# EAGLE design level shifter booster pack (EAGLE 6.4)
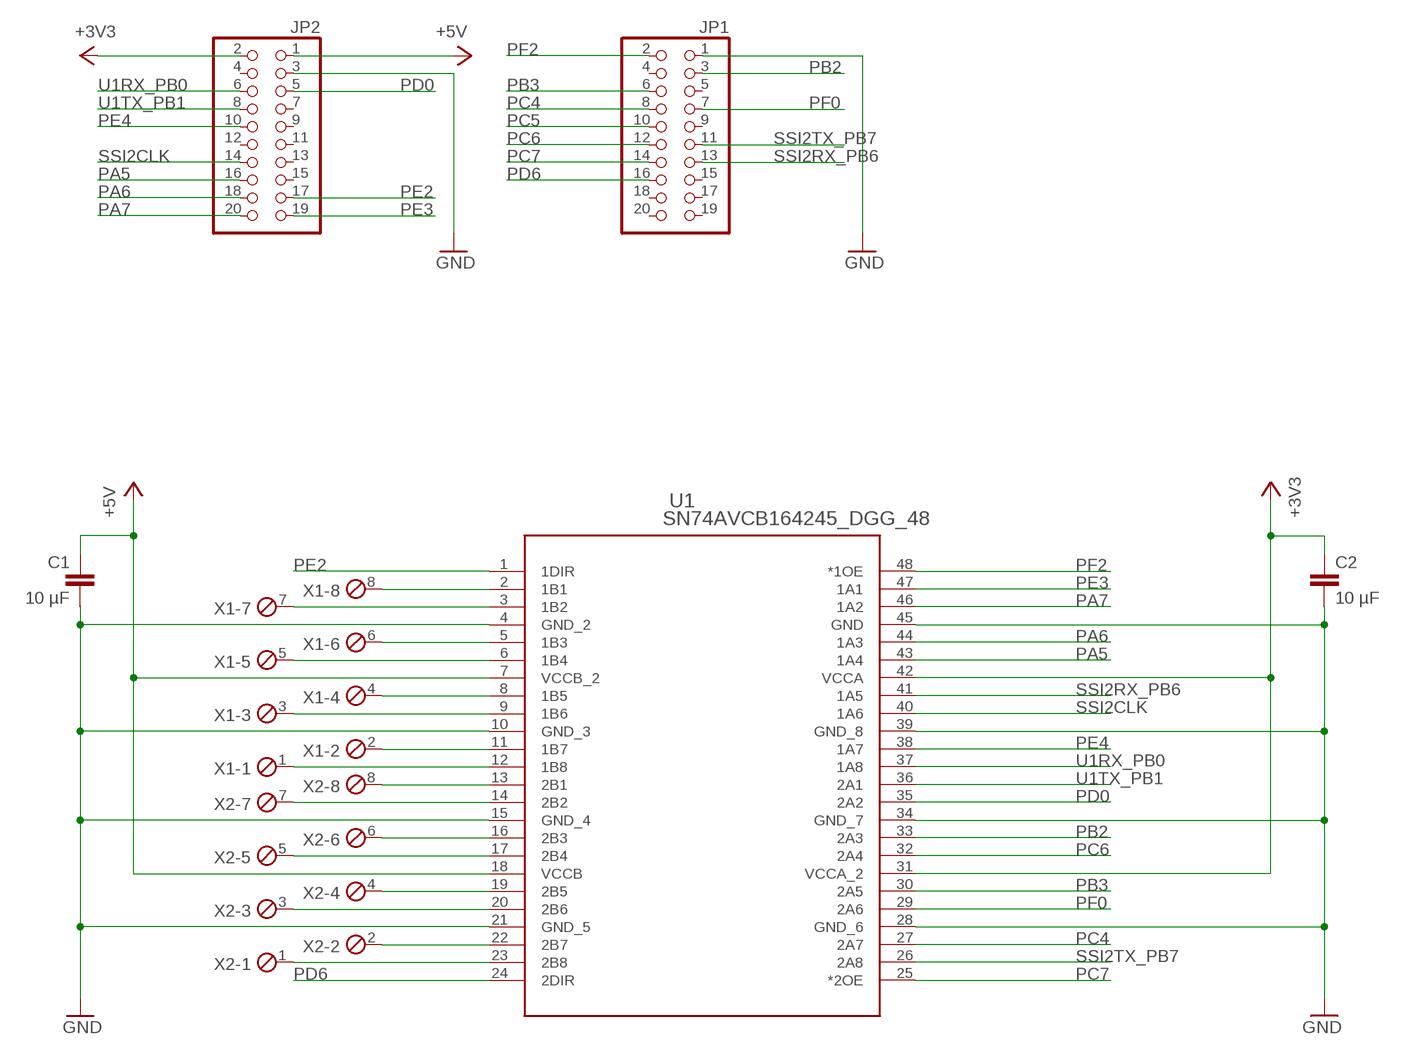
[diagram p0: schematic, sheet 1]

## Parts
C1  10 µF  C-EUC0805  [C0805]
C2  10 µF  C-EUC0805  [C0805]
JP1  PINHD-2X10  [2X10]
JP2  PINHD-2X10  [2X10]
U1  SN74AVCB164245_DGG_48  [DGG48]
X1  MPT8  [8POL254]
X2  MPT8  [8POL254]

## Nets
+3V3: C2.1 JP2.2 U1.31(VCCA_2) U1.42(VCCA)
+5V: C1.1 JP2.1 U1.7(VCCB_2) U1.18(VCCB)
GND: C1.2 C2.2 JP1.1 JP2.3 U1.4(GND_2) U1.10(GND_3) U1.15(GND_4) U1.21(GND_5) U1.28(GND_6) U1.34(GND_7) U1.39(GND_8) U1.45(GND)
N$1: U1.2(1B1) X1.8
N$2: U1.3(1B2) X1.7
N$3: U1.5(1B3) X1.6
N$4: U1.6(1B4) X1.5
N$5: U1.8(1B5) X1.4
N$6: U1.9(1B6) X1.3
N$7: U1.11(1B7) X1.2
N$8: U1.12(1B8) X1.1
N$9: U1.13(2B1) X2.8
N$10: U1.14(2B2) X2.7
N$11: U1.16(2B3) X2.6
N$12: U1.17(2B4) X2.5
N$13: U1.19(2B5) X2.4
N$14: U1.20(2B6) X2.3
N$15: U1.22(2B7) X2.2
N$16: U1.23(2B8) X2.1
PA5: JP2.16 U1.43(1A4)
PA6: JP2.18 U1.44(1A3)
PA7: JP2.20 U1.46(1A2)
PB2: JP1.3 U1.33(2A3)
PB3: JP1.6 U1.30(2A5)
PC4: JP1.8 U1.27(2A7)
PC5: JP1.10
PC6: JP1.12 U1.32(2A4)
PC7: JP1.14 U1.25(*2OE)
PD0: JP2.5 U1.35(2A2)
PD6: JP1.16 U1.24(2DIR)
PE2: JP2.17 U1.1(1DIR)
PE3: JP2.19 U1.47(1A1)
PE4: JP2.10 U1.38(1A7)
PF0: JP1.7 U1.29(2A6)
PF2: JP1.2 U1.48(*1OE)
SSI2CLK: JP2.14 U1.40(1A6)
SSI2RX_PB6: JP1.13 U1.41(1A5)
SSI2TX_PB7: JP1.11 U1.26(2A8)
U1RX_PB0: JP2.6 U1.37(1A8)
U1TX_PB1: JP2.8 U1.36(2A1)
Unconnected: JP1.4 JP1.5 JP1.9 JP1.15 JP1.17 JP1.18 JP1.19 JP1.20 JP2.4 JP2.7 JP2.9 JP2.11 JP2.12 JP2.13 JP2.15

## Library data of the parts
C1 C2 = rcl:C-EU: CAPACITOR, European symbol
JP1 JP2 = pinhead:PINHD-2X10: PIN HEADER
U1 = 74AVCB164245GR:SN74AVCB164245_DGG_48; DATASHEETURL: http://www.ti.com/lit/gpn/SN74AVCB164245; DESCRIPTION: 16-Bit Dual-Supply Bus Transceiver w/ Config. Xlation and 3-State Outputs; FAMILY_NAME: DIRECTION CONTROL DUAL SUPPLY TRANSLATOR; GENERIC_PART_NUMBER: SN74AVCB164245; INDUSTRY_STD_PKG_TYPE: TSSOP; MANUFACTURER: Texas Instruments; MANUFACTURER_PART_NUMBER: sn74avcb164245_dgg_48; PACKAGE_DESIGNATOR: DGG; PIN_COUNT: 48; VENDOR: Texas Instruments
X1 X2 = con-phoenix-254:MPT8: PHOENIX CONNECTOR; OC_FARNELL: unknown; OC_NEWARK: unknown

## Board
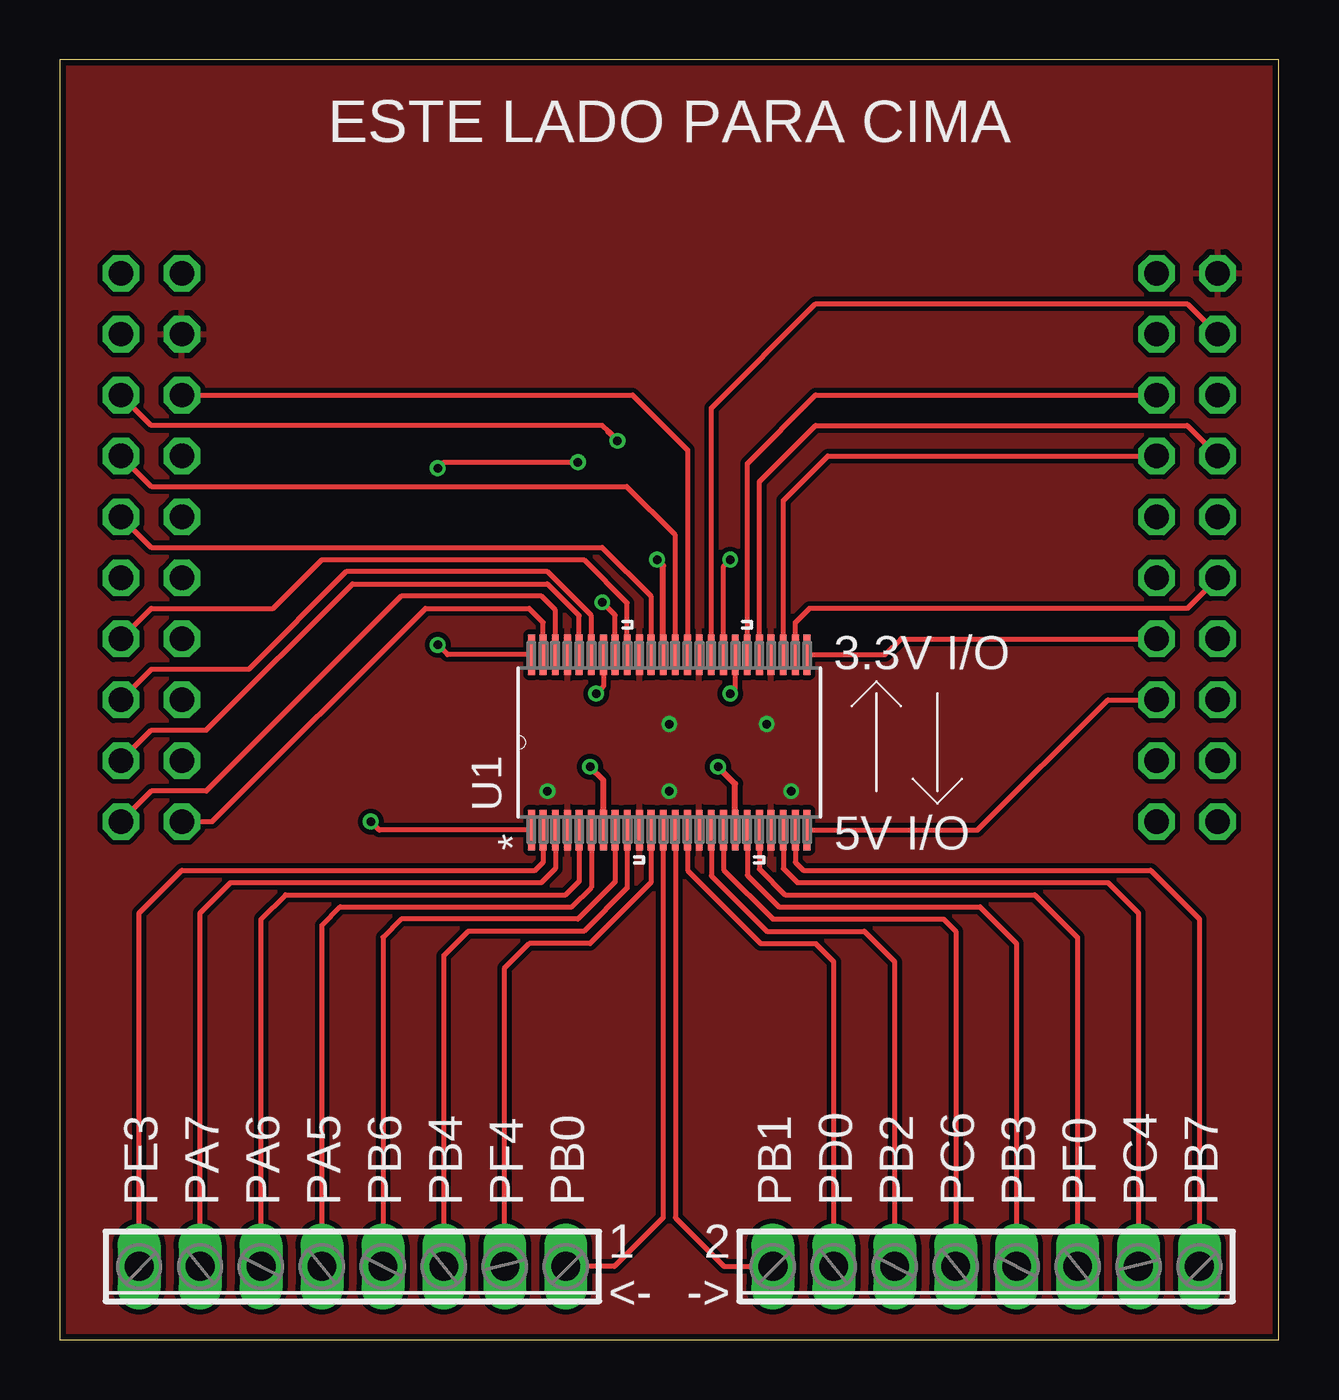
[diagram p1: board, top side]
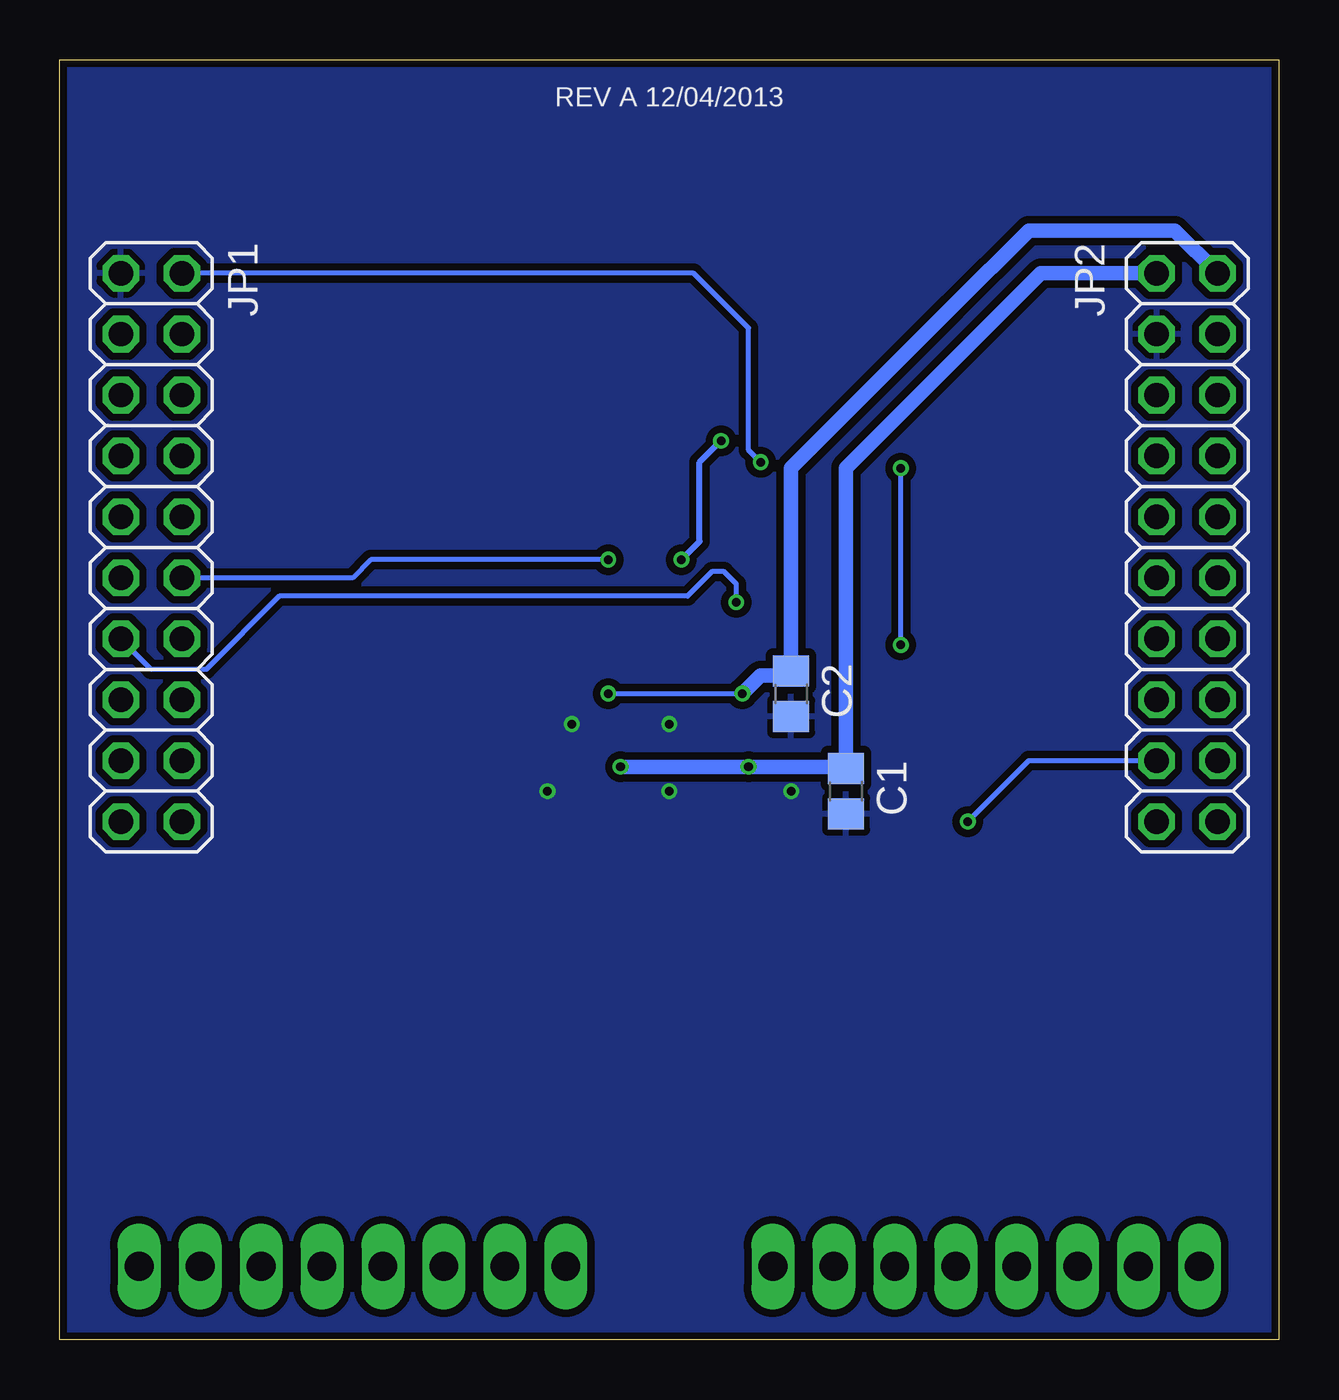
[diagram p2: board, bottom side, seen from below]

Size 50.8 x 53.34 mm. Coordinates in mm from the lower left corner, seen from the top.
Outline: 0,0 50.8,0 50.8,53.34 0,53.34 0,0
Copper layers (1*16): Top 0.035mm / dielectric 1.5mm / Bottom 0.035mm
Design rules "Fusion_eagle_rule_v1.1": minimum track width 6mil, minimum drill 12mil, track to track 6mil, track to pad 6mil, pad to pad 6mil, via to via 6mil, smd to smd 0mil, copper to edge 10mil, drill to drill 10mil, minimum pad ring 10mil, minimum via ring 6mil, stop-mask expansion 2mil, vias tented up to drill 100mil, thermal gap 10mil

### Footprints (pad centres in the part's own frame; a part is rotated, then mirrored left to right if it is on the bottom)
C0805 = smd 1.3 x 1.5: 1 -0.95,0; 2 0.95,0
2X10 = drill 1.016 octagon: 1 -11.43,-1.27; 2 -11.43,1.27; 3 -8.89,-1.27; 4 -8.89,1.27; 5 -6.35,-1.27; 6 -6.35,1.27; 7 -3.81,-1.27; 8 -3.81,1.27; 9 -1.27,-1.27; 10 -1.27,1.27; 11 1.27,-1.27; 12 1.27,1.27; 13 3.81,-1.27; 14 3.81,1.27; 15 6.35,-1.27; 16 6.35,1.27; 17 8.89,-1.27; 18 8.89,1.27; 19 11.43,-1.27; 20 11.43,1.27
DGG48 = smd 1.676 x 0.279: 1 -3.658,5.74; 2 -3.658,5.258; 3 -3.658,4.75; 4 -3.658,4.242; 5 -3.658,3.759; 6 -3.658,3.251; 7 -3.658,2.743; 8 -3.658,2.261; 9 -3.658,1.753; 10 -3.658,1.245; 11 -3.658,0.762; 12 -3.658,0.254; 13 -3.658,-0.254; 14 -3.658,-0.762; 15 -3.658,-1.245; 16 -3.658,-1.753; 17 -3.658,-2.261; 18 -3.658,-2.743; 19 -3.658,-3.251; 20 -3.658,-3.759; 21 -3.658,-4.242; 22 -3.658,-4.75; 23 -3.658,-5.258; 24 -3.658,-5.74; 25 3.658,-5.74; 26 3.658,-5.258; 27 3.658,-4.75; 28 3.658,-4.242; 29 3.658,-3.759; 30 3.658,-3.251; 31 3.658,-2.743; 32 3.658,-2.261; 33 3.658,-1.753; 34 3.658,-1.245; 35 3.658,-0.762; 36 3.658,-0.254; 37 3.658,0.254; 38 3.658,0.762; 39 3.658,1.245; 40 3.658,1.753; 41 3.658,2.261; 42 3.658,2.743; 43 3.658,3.251; 44 3.658,3.759; 45 3.658,4.242; 46 3.658,4.75; 47 3.658,5.258; 48 3.658,5.74
8POL254 = drill 1.2 long: 1 -8.89,0; 2 -6.35,0; 3 -3.81,0; 4 -1.27,0; 5 1.27,0; 6 3.81,0; 7 6.35,0; 8 8.89,0

### Placement (x,y rotation side)
C1  18.03,22.86 270 bottom
C2  20.32,26.92 270 bottom
JP1  46.99,33.02 270 bottom
JP2  3.81,33.02 270 bottom
U1  25.4,24.89 90 top
X1  12.19,3.05 180 top
X2  38.61,3.05 180 top

### Tracks (layer width: path | path; a pad name or v marks a point on that pad's centre or on a via)
+3V3  (via drill 0.36)
  Top 0.203: U1.31 28.14,27.13 v27.94,26.92 | U1.42 22.66,27.23 v22.35,26.92
  Bottom 0.203: v27.94,26.92 v22.35,26.92
  Bottom 0.254: 13.46,43.18 13.59,43.05
  Bottom 0.61: JP2.2 4.32,46.23 10.41,46.23 13.59,43.05 20.32,36.32 C2.1 20.51,27.69 21.59,27.69 v22.35,26.92
+5V  (via drill 0.36)
  Top 0.254: v27.43,23.88 28.14,23.16 U1.18 | v22.1,23.88 22.66,23.32 U1.7
  Bottom 0.61: v27.43,23.88 v22.1,23.88 18.1,23.88 C1.1 18.03,36.32 9.91,44.45 JP2.1
GND  (via drill 0.36)
  other vias: 20.32,22.86 25.4,22.86 30.48,22.86 25.4,25.65 29.46,25.65
  pour Top (isolate 0.203): 0,0 50.8,0 50.8,53.34 0,53.34
  pour Bottom (isolate 0.305): 0,0 50.8,0 50.8,53.34 0,53.34
N$1
  Top 0.203: X1.8 3.3,17.78 5.08,19.56 19.81,19.56 20.14,19.89 U1.2
N$2
  Top 0.203: X1.7 5.84,17.78 7.11,19.05 20.07,19.05 20.65,19.63 U1.3
N$3
  Top 0.203: X1.6 8.38,17.53 9.4,18.54 21.08,18.54 21.64,19.1 U1.5
N$4
  Top 0.203: X1.5 10.92,17.27 11.68,18.03 21.34,18.03 22.15,18.85 U1.6
N$5
  Top 0.203: U1.8 23.14,19.07 21.59,17.53 14.22,17.53 13.46,16.76 X1.4
N$6
  Top 0.203: U1.9 23.65,18.82 21.84,17.02 17.02,17.02 16,16 X1.3
N$7
  Top 0.203: U1.11 24.64,19.05 22.1,16.51 19.56,16.51 18.54,15.49 X1.2
N$8
  Top 0.203: U1.12 25.15,5.08 23.11,3.05 X1.1
N$9
  Top 0.203: U1.13 25.65,5.08 27.69,3.05 X2.8
N$10
  Top 0.203: U1.14 26.16,19.56 29.21,16.51 31.5,16.51 32.26,15.75 X2.7
N$11
  Top 0.203: U1.16 27.15,19.33 29.46,17.02 33.53,17.02 34.8,15.75 X2.6
N$12
  Top 0.203: U1.17 27.66,19.58 29.72,17.53 36.83,17.53 37.34,17.02 X2.5
N$13
  Top 0.203: U1.19 28.65,19.36 29.97,18.03 38.35,18.03 39.88,16.51 X2.4
N$14
  Top 0.203: U1.20 29.16,19.61 30.23,18.54 40.64,18.54 42.42,16.76 X2.3
N$15
  Top 0.203: U1.22 30.15,19.63 30.73,19.05 43.69,19.05 44.96,17.78 X2.2
N$16
  Top 0.203: U1.23 30.66,19.89 30.99,19.56 45.47,19.56 47.5,17.53 X2.1
PA5
  Top 0.203: U1.43 22.15,30.18 20.32,32 11.94,32 7.87,27.94 3.81,27.94 JP2.16
PA6
  Top 0.203: JP2.18 3.81,25.4 6.1,25.4 12.19,31.5 20.32,31.5 21.64,30.18 U1.44
PA7
  Top 0.203: U1.46 20.65,30.4 20.07,30.99 14.22,30.99 6.1,22.86 3.81,22.86 JP2.20
PB2
  Top 0.203: U1.33 27.15,38.84 31.5,43.18 46.99,43.18 JP1.3
PB3
  Top 0.203: U1.30 28.65,36.52 31.5,39.37 JP1.6
PC4
  Top 0.203: U1.27 30.15,34.98 32,36.83 JP1.8
PC6  (via drill 0.36)
  Top 0.203: U1.32 27.66,32.23 v27.94,32.51
  Bottom 0.203: JP1.12 38.61,31.75 37.85,32.51 v27.94,32.51
PC7
  Top 0.203: U1.25 34.39,28.55 35.05,29.21 JP1.14
PD0
  Top 0.203: JP2.5 23.88,39.37 26.16,37.08 U1.35
PD6
  Top 0.203: U1.24 38.25,21.23 43.69,26.67 JP1.16
PE2  (via drill 0.36)
  Top 0.203: U1.1 13.31,21.23 v12.95,21.59
  Bottom 0.203: v12.95,21.59 10.41,24.13 JP2.17
PE3
  Top 0.203: JP2.19 6.35,21.59 15.24,30.48 19.56,30.48 20.14,29.9 U1.47
PE4
  Top 0.203: JP2.10 3.81,33.02 22.61,33.02 24.64,30.99 U1.38
PF0
  Top 0.203: U1.29 29.16,35.76 31.5,38.1 46.99,38.1 JP1.7
PF2  (via drill 0.36)
  Top 0.203: U1.48 16.15,28.55 v15.75,28.96 | v15.75,36.32 16,36.58 v21.59,36.58
  Bottom 0.203: v15.75,28.96 v15.75,36.32 | v21.59,36.58 22.1,37.08 22.1,42.16 24.38,44.45 JP1.2
SSI2CLK
  Top 0.203: U1.40 23.65,30.71 21.84,32.51 10.92,32.51 8.89,30.48 3.81,30.48 JP2.14
SSI2RX_PB6  (via drill 0.36)
  Top 0.203: U1.41 23.14,30.2 v22.61,30.73
  Bottom 0.203: JP1.13 46.99,27.94 44.7,27.94 41.66,30.99 24.64,30.99 23.62,32 23.11,32 22.61,31.5 v22.61,30.73
SSI2TX_PB7
  Top 0.203: U1.26 30.66,29.9 31.24,30.48 46.99,30.48 JP1.11
U1RX_PB0  (via drill 0.36)
  Top 0.203: JP2.6 3.81,38.1 22.61,38.1 22.86,37.85
  Top 0.254: U1.37 25.15,32.26 v24.89,32.51 | v23.24,37.47 22.86,37.85
  Bottom 0.254: v23.24,37.47 24.13,36.58 24.13,33.27 v24.89,32.51
U1TX_PB1
  Top 0.203: JP2.8 3.81,35.56 23.62,35.56 25.65,33.53 U1.36

### Text on the board
tPlace: ESTE LADO PARA CIMA | 3.3V I/O | 5V I/O | PE3 | PA7 | PA6 | PA5 | PB6 | PB4 | PF4 | PB0 | PB1 | PD0 | PB2 | PC6 | PB3 | PF0 | PC4 | PB7 | 1 / <- | 2 / ->
bPlace: REV A 12/04/2013